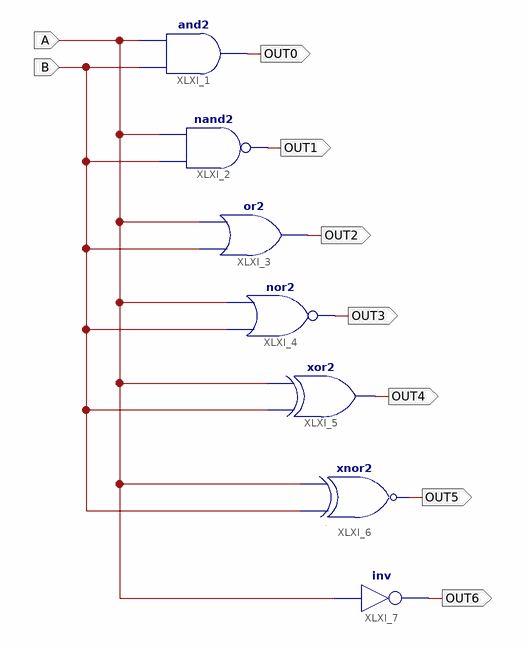
[diagram p0: schematic sheet 1]
// Xilinx ISE schematic gates.sch (spartan3) as structural Verilog: 7 symbols, 9 ports
module gates (
  input  B,
  input  A,
  output OUT6,
  output OUT2,
  output OUT5,
  output OUT4,
  output OUT3,
  output OUT1,
  output OUT0
);

  and XLXI_1 (OUT0, B, A);
  nand XLXI_2 (OUT1, B, A);
  or XLXI_3 (OUT2, B, A);
  nor XLXI_4 (OUT3, B, A);
  xor XLXI_5 (OUT4, B, A);
  xnor XLXI_6 (OUT5, B, A);
  not XLXI_7 (OUT6, A);
endmodule
